# EAGLE schematic dust_environment_sensor_v2 (EAGLE 6.4)
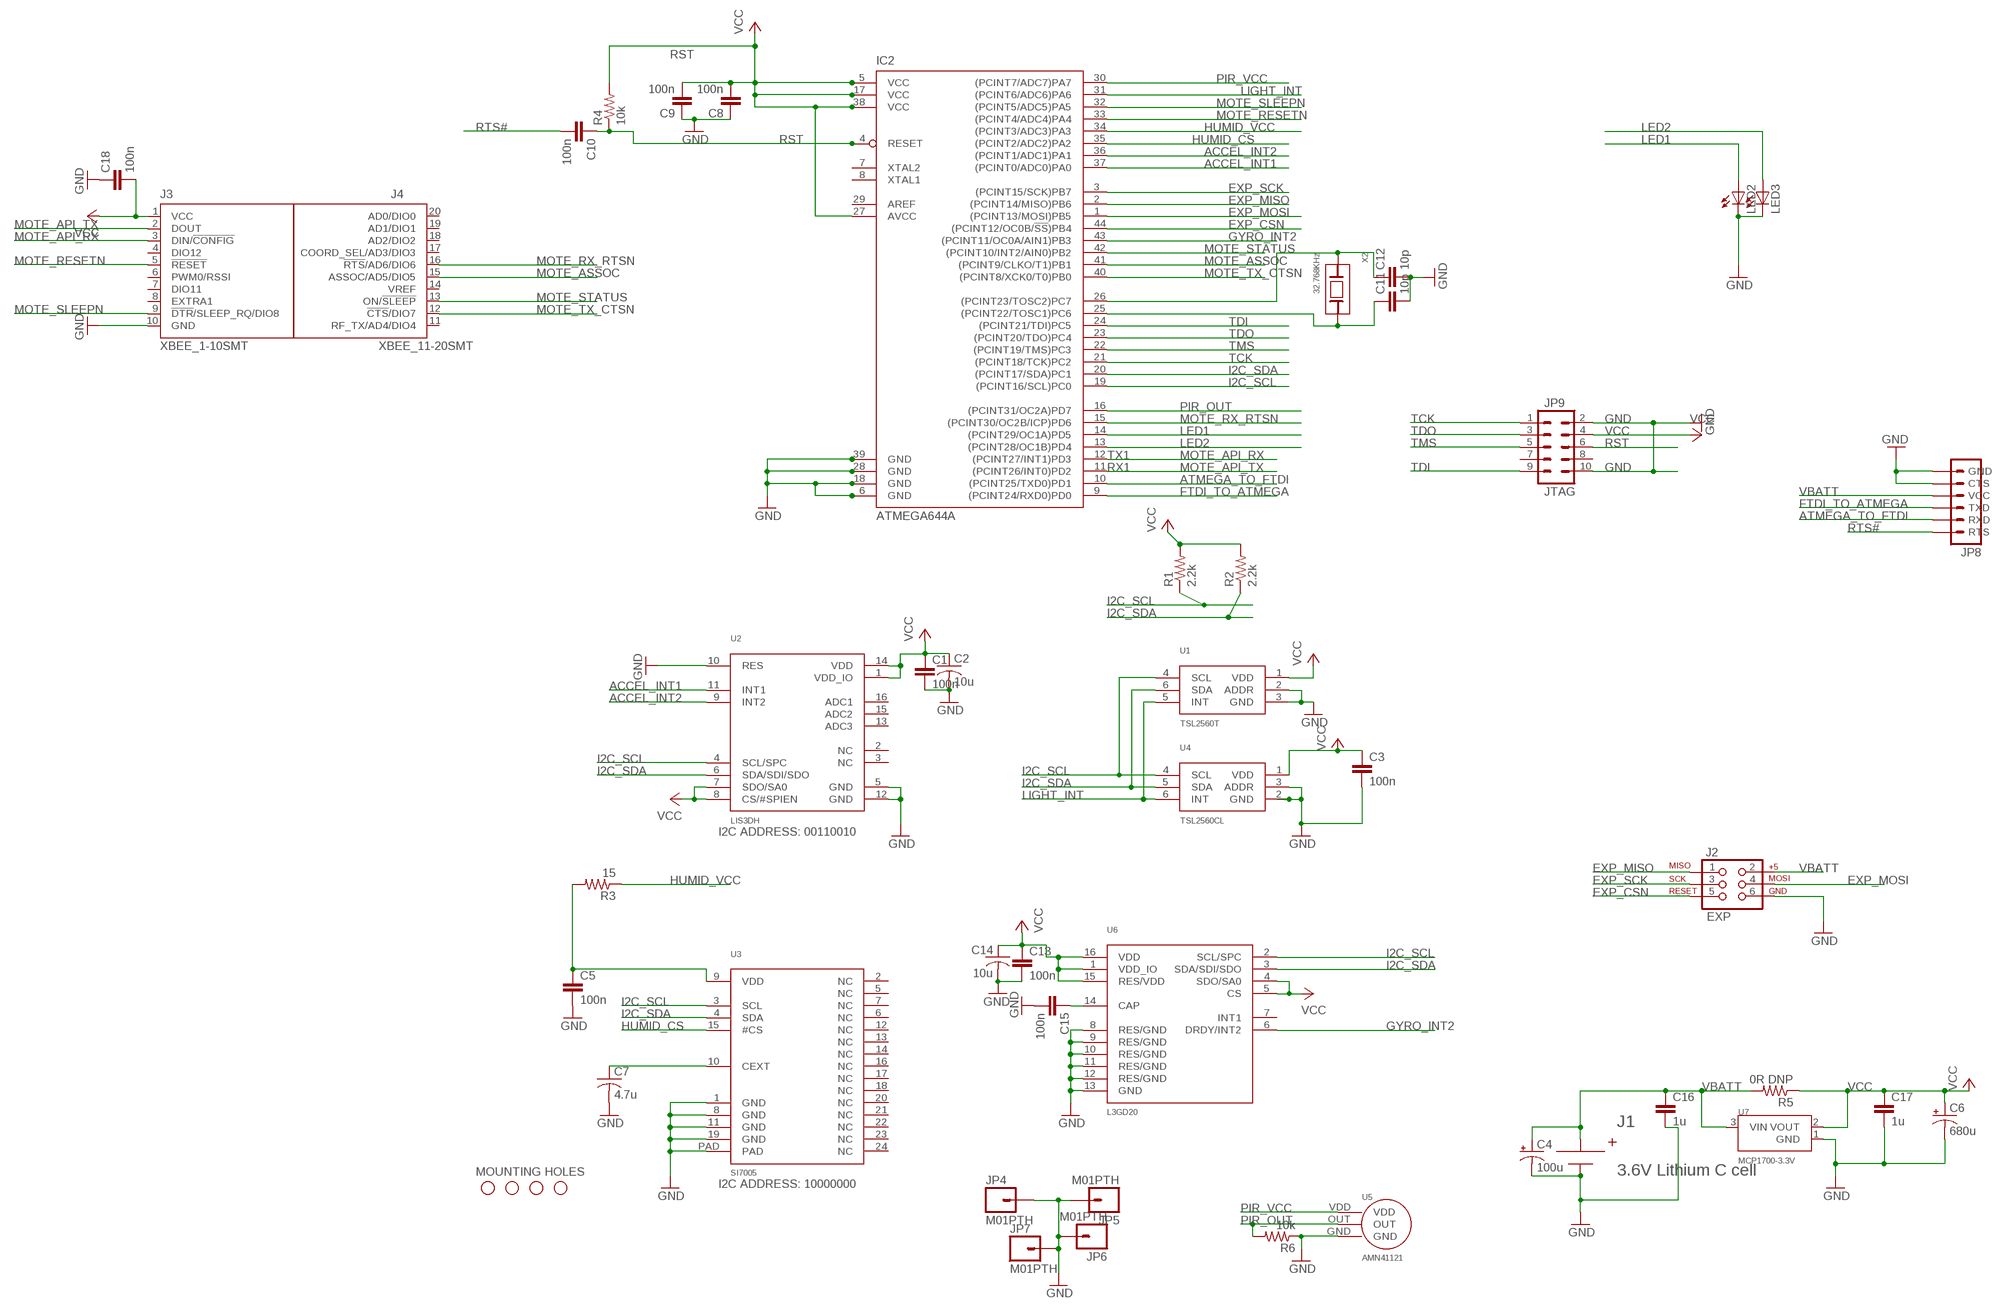
[diagram p0: schematic, sheet 1]

## Parts
C1  100n  C-EUC0603  [C0603]
C2  10u  C-USC0603  [C0603]
C3  100n  C-EUC0603  [C0603]
C4  100u  CAP_POL1206-KIT  [EIA3216-KIT]
C5  100n  C-EUC0603  [C0603]
C6  680u  CAP_POL7343  [EIA7343]
C7  4.7u  C-USC0603  [C0603]
C8  100n  C-EUC0603  [C0603]
C9  100n  C-EUC0603  [C0603]
C10  100n  C-EUC0603  [C0603]
C11  10p  C-EUC0603  [C0603]
C12  10p  C-EUC0603  [C0603]
C13  100n  C-EUC0603  [C0603]
C14  10u  C-USC0603  [C0603]
C15  100n  C-EUC0603  [C0603]
C16  1u  C-EUC0603  [C0603]
C17  1u  C-EUC0603  [C0603]
C18  100n  C-EUC0603  [C0603]
IC2  ATMEGA644A  [TQFP44]
J1  3.6V Lithium C cell  BX0036  [BX0036]
J2  EXP  AVR_SPI_PRG_6PTH  [2X3]
J3  XBEE_1-10SMT  [XBEE_1-10_SMT]
J4  XBEE_11-20SMT  [XBEE_11-20_SMT]
JP4  M01PTH  [1X01]
JP5  M01PTH  [1X01]
JP6  M01PTH  [1X01]
JP7  M01PTH  [1X01]
JP8  FTDI_CABLESIP  [1X06]
JP9  JTAG  M05X2PTH  [AVR_ICSP]
LED2  LEDCHIPLED_0805  [CHIPLED_0805]
LED3  LEDCHIPLED_0805  [CHIPLED_0805]
R1  2.2k  R-US_R0603  [R0603]
R2  2.2k  R-US_R0603  [R0603]
R3  15  R-US_R0603  [R0603]
R4  10k  R-US_R0603  [R0603]
R5  0R DNP  R-US_R0603  [R0603]
R6  10k  R-US_R0603  [R0603]
STANDOFF1  STAND-OFF  [STAND-OFF]
STANDOFF2  STAND-OFF  [STAND-OFF]
STANDOFF3  STAND-OFF  [STAND-OFF]
STANDOFF4  STAND-OFF  [STAND-OFF]
U1  TSL2560T  [T_TAOS]
U2  LIS3DH  [LGA16_ST]
U3  SI7005  [QFN24_SILICON_LABS]
U4  TSL2560CL  [CL6_TAOS]
U5  AMN41121  [AMN41121]
U6  L3GD20  [LGA16_4X4_ST]
U7  MCP1700-3.3V  MCP1700  [SOT23-3]
X2  32.768KHz  XTALABS07  [ABS07]

## Nets
ACCEL_INT1: IC2.37((PCINT0/ADC0)PA0) U2.11(INT1)
ACCEL_INT2: IC2.36((PCINT1/ADC1)PA1) U2.9(INT2)
ATMEGA_TO_FTDI: IC2.10((PCINT25/TXD0)PD1) JP8.5(RXD)
EXP_CSN: IC2.44((PCINT12/OC0B/!SS!)PB4) J2.5
EXP_MISO: IC2.2((PCINT14/MISO)PB6) J2.1
EXP_MOSI: IC2.1((PCINT13/MOSI)PB5) J2.4
EXP_SCK: IC2.3((PCINT15/SCK)PB7) J2.3
FTDI_TO_ATMEGA: IC2.9((PCINT24/RXD0)PD0) JP8.4(TXD)
GND: C1.2 C2.2 C3.2 C4.C(-) C5.2 C6.C(-) C7.2 C8.1 C9.1 C11.2 C12.2 C13.2 C14.2 C15.2 C16.2 C17.2 C18.1 IC2.6(GND) IC2.18(GND) IC2.28(GND) IC2.39(GND) J1.NEG J2.6 J3.10(GND) JP4.1 JP5.1 JP6.1 JP7.1 JP8.1(GND) JP8.2(CTS) JP9.2 JP9.10 LED2.C LED3.C R6.1 U1.2(ADDR) U1.3(GND) U2.5(GND) U2.10(RES) U2.12(GND) U3.1(GND) U3.8(GND) U3.11(GND) U3.19(GND) U3.PAD U4.2(GND) U4.3(ADDR) U5.GND U6.8(RES/GND) U6.9(RES/GND) U6.10(RES/GND) U6.11(RES/GND) U6.12(RES/GND) U6.13(GND) U7.1(GND)
GYRO_INT2: IC2.43((PCINT11/OC0A/AIN1)PB3) U6.6(DRDY/INT2)
HUMID_CS: IC2.35((PCINT2/ADC2)PA2) U3.15(#CS)
HUMID_VCC: IC2.34((PCINT3/ADC3)PA3) R3.1
I2C_SCL: IC2.19((PCINT16/SCL)PC0) R1.1 U1.4(SCL) U2.4(SCL/SPC) U3.3(SCL) U4.4(SCL) U6.2(SCL/SPC)
I2C_SDA: IC2.20((PCINT17/SDA)PC1) R2.1 U1.6(SDA) U2.6(SDA/SDI/SDO) U3.4(SDA) U4.5(SDA) U6.3(SDA/SDI/SDO)
LED1: IC2.14((PCINT29/OC1A)PD5) LED2.A
LED2: IC2.13((PCINT28/OC1B)PD4) LED3.A
LIGHT_INT: IC2.31((PCINT6/ADC6)PA6) U1.5(INT) U4.6(INT)
MOTE_API_RX: IC2.12((PCINT27/INT1)PD3) J3.3(DIN/!CONFIG)
MOTE_API_TX: IC2.11((PCINT26/INT0)PD2) J3.2(DOUT)
MOTE_ASSOC: IC2.41((PCINT9/CLKO/T1)PB1) J4.15(ASSOC/AD5/DIO5)
MOTE_RESETN: IC2.33((PCINT4/ADC4)PA4) J3.5(!RESET)
MOTE_RX_RTSN: IC2.15((PCINT30/OC2B/ICP)PD6) J4.16(!RTS!/AD6/DIO6)
MOTE_SLEEPN: IC2.32((PCINT5/ADC5)PA5) J3.9(!DTR!/SLEEP_RQ/DIO8)
MOTE_STATUS: IC2.42((PCINT10/INT2/AIN0)PB2) J4.13(ON/!SLEEP)
MOTE_TX_CTSN: IC2.40((PCINT8/XCK0/T0)PB0) J4.12(!CTS!/DIO7)
N$1: C7.1 U3.10(CEXT)
N$2: C15.1 U6.14(CAP)
N$6: C11.1 IC2.25((PCINT22/TOSC1)PC6) X2.2(B)
N$7: C12.1 IC2.26((PCINT23/TOSC2)PC7) X2.1(A)
N$11: C5.1 R3.2 U3.9(VDD)
PIR_OUT: IC2.16((PCINT31/OC2A)PD7) R6.2 U5.OUT
PIR_VCC: IC2.30((PCINT7/ADC7)PA7) U5.VDD
RST: C10.1 IC2.4(RESET) JP9.6 R4.1
RTS#: C10.2 JP8.6(RTS)
TCK: IC2.21((PCINT18/TCK)PC2) JP9.1
TDI: IC2.24((PCINT21/TDI)PC5) JP9.9
TDO: IC2.23((PCINT20/TDO)PC4) JP9.3
TMS: IC2.22((PCINT19/TMS)PC3) JP9.5
VBATT: C4.A(+) C16.1 J1.POS J2.2 JP8.3(VCC) R5.2 U7.3(VIN)
VCC: C1.1 C2.1 C3.1 C6.A(+) C8.2 C9.2 C13.1 C14.1 C17.1 C18.2 IC2.5(VCC) IC2.17(VCC) IC2.27(AVCC) IC2.38(VCC) J3.1(VCC) JP9.4 R1.2 R2.2 R4.2 R5.1 U1.1(VDD) U2.1(VDD_IO) U2.7(SDO/SA0) U2.8(CS/#SPIEN) U2.14(VDD) U4.1(VDD) U6.1(VDD_IO) U6.4(SDO/SA0) U6.5(CS) U6.15(RES/VDD) U6.16(VDD) U7.2(VOUT)
Unconnected: IC2.7(XTAL2) IC2.8(XTAL1) IC2.29(AREF) J3.4(DIO12) J3.6(PWM0/RSSI) J3.7(DIO11) J3.8(EXTRA1) J4.11(RF_TX/AD4/DIO4) J4.14(VREF) J4.17(COORD_SEL/AD3/DIO3) J4.18(AD2/DIO2) J4.19(AD1/DIO1) J4.20(AD0/DIO0) JP9.7 JP9.8 U2.2(NC) U2.3(NC) U2.13(ADC3) U2.15(ADC2) U2.16(ADC1) U3.2(NC) U3.5(NC) U3.6(NC) U3.7(NC) U3.12(NC) U3.13(NC) U3.14(NC) U3.16(NC) U3.17(NC) U3.18(NC) U3.20(NC) U3.21(NC) U3.22(NC) U3.23(NC) U3.24(NC) U6.7(INT1)

## Notes on the sheet
- TX1
- RX1
- I2C ADDRESS: 00110010
- MOUNTING HOLES
- I2C ADDRESS: 10000000

## Library data of the parts
C1 C3 C5 C8-C13 C15-C18 = rcl:C-EU: CAPACITOR, European symbol
C2 C7 C14 = rcl:C-US: CAPACITOR, American symbol
C4 C6 = SparkFun-Capacitors:CAP_POL: Capacitor Polarized These are standard SMD and PTH capacitors. Normally 10uF, 47uF, and 100uF in electrolytic and tantalum varieties. Always verify the external diameter of the through hole cap, it varies with capacity, voltage, and manufacturer. The EIA devices should be standard.
IC2 = atmel:ATMEGA644: 8-bit Microcontroller with 64K Bytes In-System Programmable Flash Source: http://www.atmel.com/dyn/resources/prod_documents/doc2593.pdf; MPN: ATMEGA644PV-10AU; OC_FARNELL: 1455123; OC_NEWARK: 58M3748
J1 = Cool_Electricity:BX0036: BX0036 C-cell battery holder
J2 = SparkFun-Connectors:AVR_SPI_PRG_6: AVR ISP 6 Pin This is the reduced ISP connector for AVR programming. Common on Arduino. This footprint will take up less PCB space and can be used with a 10-pin to 6-pin adapter such as SKU: BOB-08508
J3 = Cool_Electricity:XBEE_1-10
J4 = Cool_Electricity:XBEE_11-20
JP4-JP7 = SparkFun-Connectors:M01: Header 1 Standard 1-pin 0.1" header. Use with straight break away headers (SKU : PRT-00116), right angle break away headers (PRT-00553), swiss pins (PRT-00743), machine pins (PRT-00117), and female headers (PRT-00115).
JP8 = custom:FTDI_CABLE: Header 6 Standard 6-pin 0.1" header. Use with straight break away headers (SKU : PRT-00116), right angle break away headers (PRT-00553), swiss pins (PRT-00743), machine pins (PRT-00117), and female headers (PRT-00115). Molex polarized connector foot print use with SKU : PRT-08094 with associated crimp pins and housings. NOTES ON THE VARIANTS LOCK and LOCK_LONGPADS... This footprint was designed to help hold the alignment of a through-hole component (i.e. 6-pin header) while soldering it into place. You may notice that each hole has been shifted either up or down by 0.005 of an inch from it's more standard position (which is a perfectly straight line). This slight alteration caused the pins (the squares in the middle) to touch the edges of the holes. Because they are alternating, it causes a "brace" to hold the component in place. 0.005 has proven to be the perfect amount of "off-center" position when using our standard breakaway headers. Although looks a little odd when you look at the bare footprint, once you have a header in there, the alteration is very hard to notice. Also, if you push a header all the way into place, it is covered up entirely on the bottom side. This idea of altering the position of holes to aid alignment will be further integrated into the Sparkfun Library for other footprints. It can help hold any component with 3 or more connection pins.
JP9 = SparkFun-Connectors:M05X2: Header 5x2 Standard 10-pin dual row 0.1" header. Commonly used with AVR-ISP. Use with Spark Fun Electronics SKU: PRT-00778
LED2 LED3 = led:LED: LED OSRAM: - CHIPLED LG R971, LG N971, LY N971, LG Q971, LY Q971, LO R971, LY R971 LH N974, LH R974 LS Q976, LO Q976, LY Q976 LO Q996 - Hyper CHIPLED LW Q18S LB Q993, LB Q99A, LB R99A - SideLED LS A670, LO A670, LY A670, LG A670, LP A670 LB A673, LV A673, LT A673, LW A673 LH A674 LY A675 LS A676, LA A676, LO A676, LY A676, LW A676 LS A679, LY A679, LG A679 - Hyper Micro SIDELED® LS Y876, LA Y876, LO Y876, LY Y876 LT Y87S - SmartLED LW L88C, LW L88S LB L89C, LB L89S, LG L890 LS L89K, LO L89K, LY L89K LS L896, LA L896, LO L896, LY L896 - TOPLED LS T670, LO T670, LY T670, LG T670, LP T670 LSG T670, LSP T670, LSY T670, LOP T670, LYG T670 LG T671, LOG T671, LSG T671 LB T673, LV T673, LT T673, LW T673 LH T674 LS T676, LA T676, LO T676, LY T676, LB T676, LH T676, LSB T676, LW T676 LB T67C, LV T67C, LT T67C, LS T67K, LO T67K, LY T67K, LW E67C LS E67B, LA E67B, LO E67B, LY E67B, LB E67C, LV E67C, LT E67C LW T67C LS T679, LY T679, LG T679 LS T770, LO T770, LY T770, LG T770, LP T770 LB T773, LV T773, LT T773, LW T773 LH T774 LS E675, LA E675, LY E675, LS T675 LS T776, LA T776, LO T776, LY T776, LB T776 LHGB T686 LT T68C, LB T68C - Hyper Mini TOPLED® LB M676 - Mini TOPLED Santana® LG M470 LS M47K, LO M47K, LY M47K Source: http://www.osram.convergy.de LUXEON: - LUMILED® LXK2-PW12-R00, LXK2-PW12-S00, LXK2-PW14-U00, LXK2-PW14-V00 LXK2-PM12-R00, LXK2-PM12-S00, LXK2-PM14-U00 LXK2-PE12-Q00, LXK2-PE12-R00, LXK2-PE12-S00, LXK2-PE14-T00, LXK2-PE14-U00 LXK2-PB12-K00, LXK2-PB12-L00, LXK2-PB12-M00, LXK2-PB14-N00, LXK2-PB14-P00, LXK2-PB14-Q00 LXK2-PR12-L00, LXK2-PR12-M00, LXK2-PR14-Q00, LXK2-PR14-R00 LXK2-PD12-Q00, LXK2-PD12-R00, LXK2-PD12-S00 LXK2-PH12-R00, LXK2-PH12-S00 LXK2-PL12-P00, LXK2-PL12-Q00, LXK2-PL12-R00 Source: www.luxeon.com KINGBRIGHT: KA-3528ASYC Source: www.kingbright.com
R1-R6 = resistor:R-US_: RESISTOR, American symbol
STANDOFF1-STANDOFF4 = SparkFun-Electromechanical:STAND-OFF: #4 Stand Off This is the mechanical footprint for a #4 phillips button head screw. Use the keepout ring to avoid running the screw head into surrounding components. SKU : PRT-00447
U1 U4 = Cool_Electricity:TSL2560: TSL2560 Ambient Light Sensor
U2 = Cool_Electricity:LIS3DH: LIS3DH 3-axis accellerometer
U3 = Cool_Electricity:SI7005: Silicon Labs Si7005 Temperature and Humidity Sensor
U5 = Cool_Electricity:AMN41121
U6 = Cool_Electricity:L3GD20
U7 = Cool_Electricity:MCP1700: MCP1700
X2 = WSNlib:XTAL: Crystals used in OpenMote

## Net classes
0 default: width 0.254 mm, drill 0.33 mm, clearance 0.152 mm
1 power: width 0.254 mm, drill 0.33 mm, clearance 0.152 mm